# Altium schematic sheet Main.SchDoc
size Letter; Revision: 1; SheetNumber: 1; SheetTotal: 4
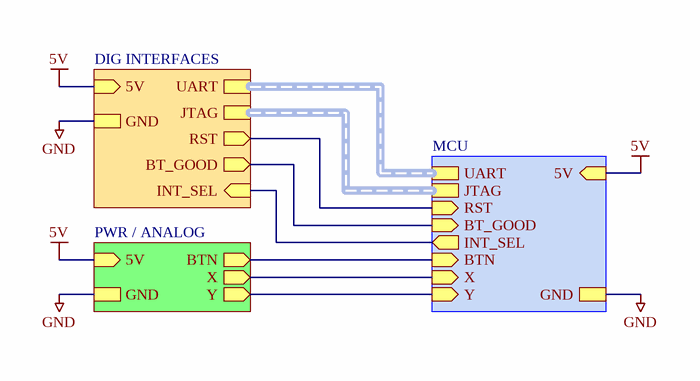
[diagram p0: Main.SchDoc]

## Sub-sheets
DIG INTERFACES = INTERFACE.SchDoc: GND, 5V (in), UART (harness MCU_UART), RST (out), JTAG (harness MCU_SPI), INT_SEL (in), BT_GOOD (out)
MCU = MCU.SchDoc: GND, 5V (in), X (in), BTN (in), Y (in), UART (harness MCU_UART), JTAG (harness MCU_SPI), RST (in), BT_GOOD (in), INT_SEL (out)
PWR / ANALOG = INPUT.SchDoc: GND, 5V (in), X (out), BTN (out), Y (out)

## Nets
5V: sheet MCU/5V, sheet PWR / ANALOG/5V, sheet DIG INTERFACES/5V
GND: sheet MCU/GND, sheet PWR / ANALOG/GND, sheet DIG INTERFACES/GND
(unnamed): sheet MCU/X, sheet PWR / ANALOG/X
(unnamed): sheet MCU/BTN, sheet PWR / ANALOG/BTN
(unnamed): sheet MCU/Y, sheet PWR / ANALOG/Y
(unnamed): sheet MCU/RST, sheet DIG INTERFACES/RST
(unnamed): sheet MCU/BT_GOOD, sheet DIG INTERFACES/BT_GOOD
(unnamed): sheet MCU/INT_SEL, sheet DIG INTERFACES/INT_SEL

## Buses and harness runs
harness sheet DIG INTERFACES/JTAG = sheet MCU/JTAG
harness sheet DIG INTERFACES/UART = sheet MCU/UART

## Notes on the sheet
- SHEET
- REVISION
- OF
- PROJECT
- REVIEWER
- ENGINEER
- DATE